# EAGLE design ir-sensor-breakout-mk-2.3-pth (EAGLE 6.5.0)
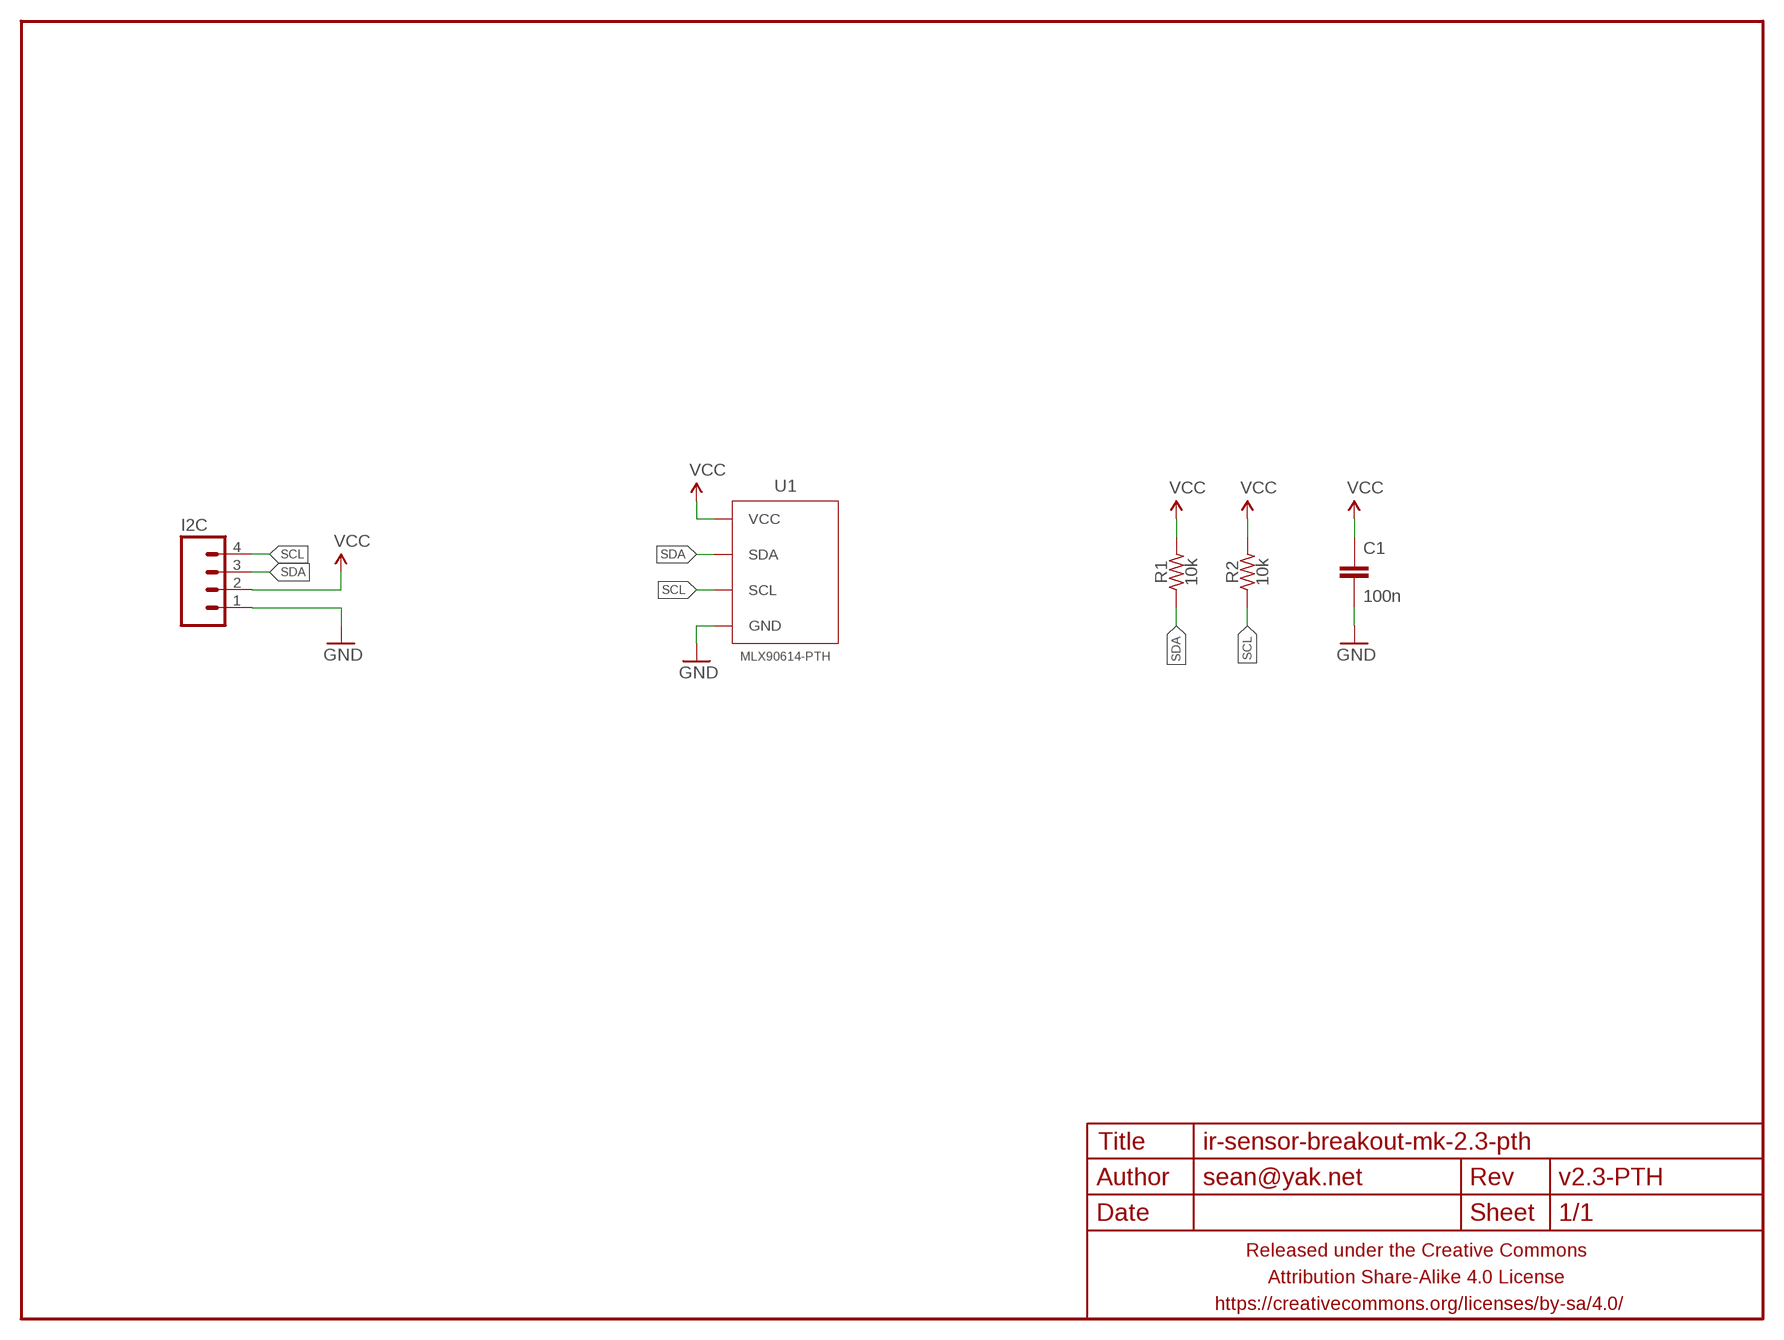
[diagram p0: schematic, sheet 1]

## Parts
C1  100n  CAPACITOR-CERAMIC025-024X044  [C025-024X044]
FRAME1  FRAME-LETTERNO_PACKAGE  [DUMMY]
I2C  M04JST-PTH-VERT  [JST-4-PH-VERT-PTH]
R1  10k  RESISTORPTH-AXIAL-5.08MM  [RESISTOR-AXIAL-PTH-5.08MM]
R2  10k  RESISTORPTH-AXIAL-5.08MM  [RESISTOR-AXIAL-PTH-5.08MM]
U1  MLX90614-PTH  MLX906145V-PTH  [TO-39-4]

## Nets
GND: C1.2 I2C.1 U1.4(GND)
SCL: I2C.4 R2.P$1 U1.1(SCL)
SDA: I2C.3 R1.P$1 U1.2(SDA)
VCC: C1.1 I2C.2 R1.P$2 R2.P$2 U1.3(VCC)

## Library data of the parts
C1 = A_butts:CAPACITOR-CERAMIC: CAPACITOR, European symbol
FRAME1 = A_butts:FRAME-LETTER: Schematic Frame Standard 8.5x11 US Letter frame; DESIGNER: sean@yak.net; VERSION: v2.3-PTH
I2C = A_butts:M04: Header 4 Standard 4-pin 0.1" header. Use with straight break away headers (SKU : PRT-00116), right angle break away headers (PRT-00553), swiss pins (PRT-00743), machine pins (PRT-00117), and female headers (PRT-00115). Molex polarized connector foot print use with SKU : PRT-08231 with associated crimp pins and housings. 1MM SMD Version SKU: PRT-10208
R1 R2 = A_butts:RESISTOR: RESISTOR, American symbol
U1 = A_butts:MLX90614

## Board
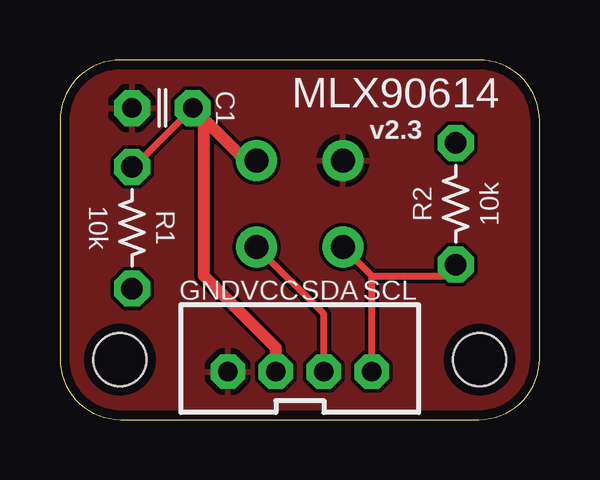
[diagram p1: board, top side]
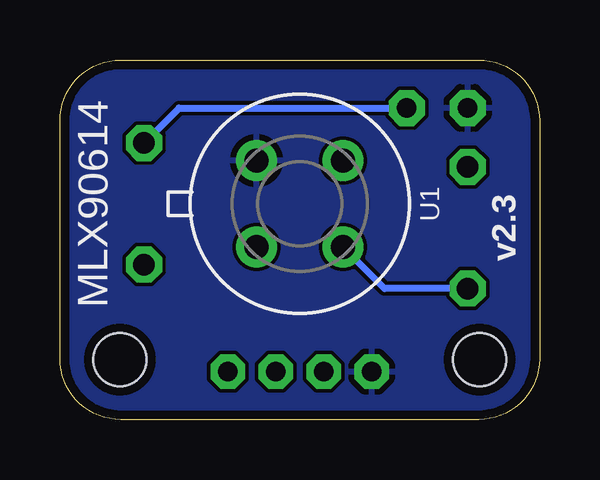
[diagram p2: board, bottom side, seen from below]

Size 20 x 15 mm. Coordinates in mm from the lower left corner, seen from the top.
Outline: 0,12.46 0,2.54 arc90 2.54,0 17.46,0 arc90 20,2.54 20,12.46 arc90 17.46,15 2.54,15 arc90 0,12.46
Copper layers (1*16): Top 0.0356mm / dielectric 1.5011mm / Bottom 0.0356mm
Design rules "LaenPCBOrder_2": minimum track width 6mil, minimum drill 13mil, track to track 6mil, track to pad 6mil, pad to pad 6mil, via to via 6mil, smd to smd 6mil, copper to edge 15mil, drill to drill 6mil, minimum pad ring 7mil, minimum via ring 7mil, stop-mask expansion 3mil, vias tented up to drill 20mil, thermal gap 10mil
Holes 2.2 mm at 17.5,2.5 2.5,2.5

### Footprints (pad centres in the part's own frame; a part is rotated, then mirrored left to right if it is on the bottom)
C025-024X044 = drill 0.813 pad 1.5 octagon: 1 -1.27,0; 2 1.27,0
JST-4-PH-VERT-PTH = drill 0.8 pad 1.422 octagon: 1 0,0; 2 2,0; 3 4,0; 4 6,0
RESISTOR-AXIAL-PTH-5.08MM = drill 0.9 pad 1.5 octagon: P$1 -2.54,0; P$2 2.54,0
TO-39-4 = drill 1 pad 1.7: 1 -1.8,1.8; 2 -1.8,-1.8; 3 1.8,-1.8; 4 1.8,1.8

### Placement (x,y rotation side)
C1  4.27,13 180 top
FRAME1  0,0 0 top
I2C  7,2 0 top
R1  3,8 90 top
R2  16.5,9 90 top
U1  10,9 90 bottom

### Tracks (layer width: path | path; a pad name or v marks a point on that pad's centre or on a via)
GND
  pour Top: 0,12.46 0,2.54 arc90 2.54,0 17.46,0 arc90 20,2.54 20,12.46 arc90 17.46,15 2.54,15 arc90
  pour Bottom: 2.54,15 17.46,15 arc-90 20,12.46 20,2.54 arc-90 17.46,0 2.54,0 arc-90 0,2.54 0,12.46 arc-90
SCL
  Top 0.3: I2C.4 13,6 | 13,6 U1.1 | 13,6 16.04,6 R2.P$1
SDA
  Top 0.3: I2C.3 11,4.4 U1.2
  Bottom 0.3: R1.P$1 6.46,5.46 U1.2
VCC
  Top 0.3: R1.P$2 3.08,10.54 C1.1
  Top 0.5: I2C.2 9,3 6,6 6,12.54 | 6,12.54 C1.1 | U1.3 7.74,10.8 6,12.54
  Bottom 0.3: R2.P$2 15.04,13 C1.1

### Text on the board
tPlace: MLX90614 | GND | VCC | SDA | SCL
bPlace: MLX90614